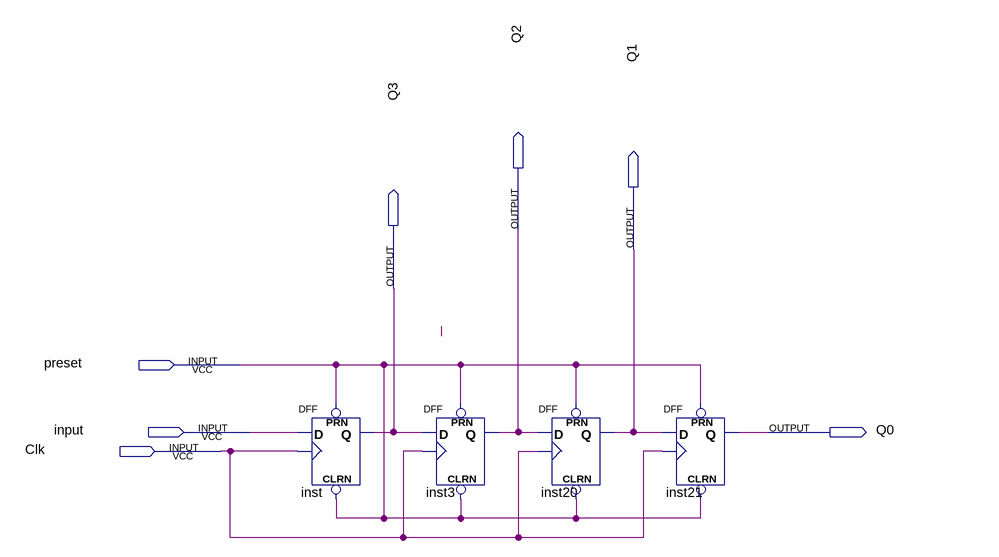
[diagram p0: schematic sheet]
// Quartus schematic lab10step1.bdf as structural Verilog: 4 symbols, 7 pins
module lab10step1 (
  input  preset,
  input  \input ,
  input  Clk,
  output Q2,
  output Q1,
  output Q3,
  output Q0
);

  DFF inst (.CLRN(preset), .CLK(Clk), .D(\input ), .PRN(preset), .Q(Q3));
  DFF inst3 (.CLRN(preset), .CLK(Clk), .D(Q3), .PRN(preset), .Q(Q2));
  DFF inst20 (.CLRN(preset), .CLK(Clk), .D(Q2), .PRN(preset), .Q(Q1));
  DFF inst21 (.CLRN(preset), .CLK(Clk), .D(Q1), .PRN(preset), .Q(Q0));
endmodule
